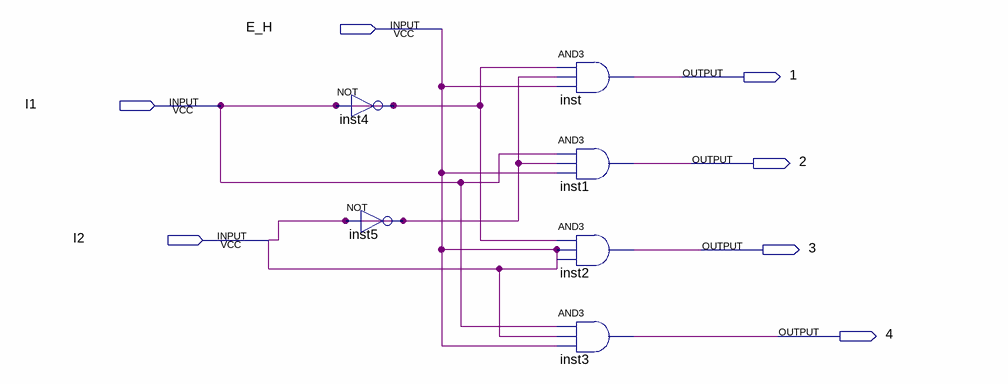
[diagram p0: schematic sheet]
// Quartus schematic DecoderDemo.bdf as structural Verilog: 6 symbols, 7 pins
module DecoderDemo (
  input  E_H,
  input  I1,
  input  I2,
  output \1 ,
  output \2 ,
  output \3 ,
  output \4 
);

  not inst4 (I1, I1);
  not inst5 (E_H, E_H);
  and inst (\1 , I1, E_H, E_H);
  and inst1 (\2 , I1, E_H, E_H);
  and inst2 (\3 , I1, E_H, E_H);
  and inst3 (\4 , I1, E_H, E_H);

  assign I2 = E_H;
endmodule
